# Altium schematic sheet USB Sheet (FT232RL).SchDoc
size A4
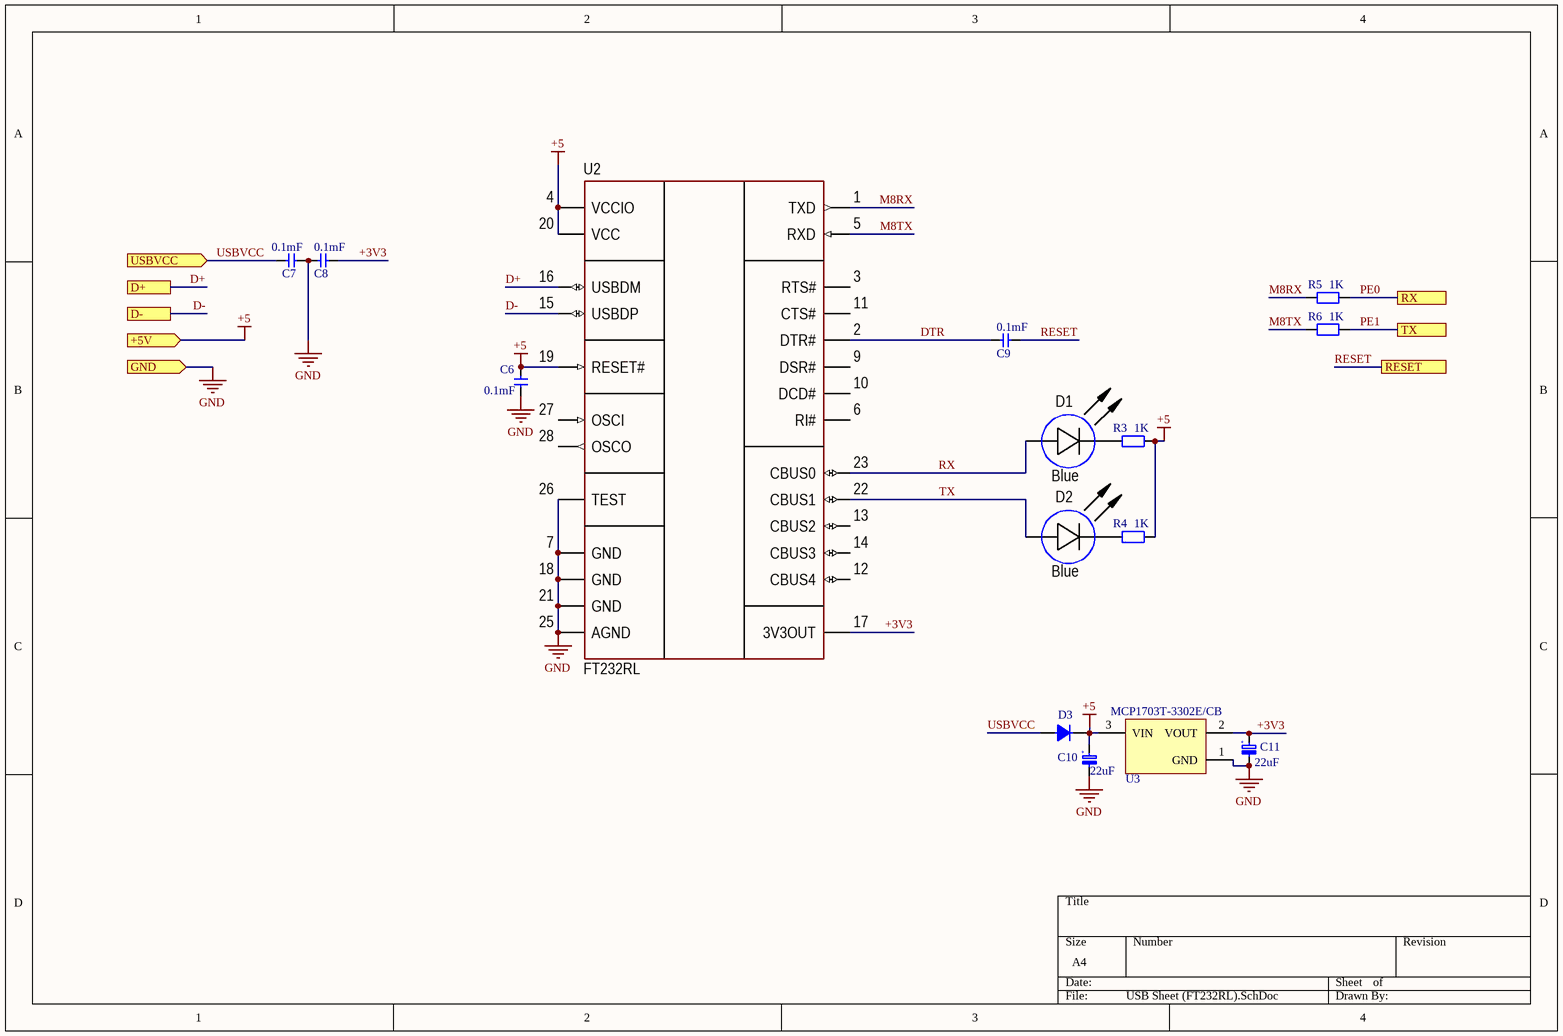
[diagram p0: USB Sheet (FT232RL).SchDoc]

## Parts
C6  0.1mF  [cap0603]
C7  0.1mF  [cap0603]
C8  0.1mF  [cap0603]
C9  0.1mF  [cap0603]
C10  22uF  [Tantal B]
C11  22uF  [Tantal B]
D1  Blue  [CH0805LB]
D2  Blue  [CH0805LB]
D3  Diode SMD  [SOD123]  (value not drawn)
R3  1K  [res0603]
R4  1K  [res0603]
R5  1K  [res0603]
R6  1K  [res0603]
U2  FT232RL  [28-SSOP]
U3  MCP1703T-3302E/CB  [SOT23-3_A]

## Ports
+5V (in), D+, D-, GND (in), RESET, RX, TX, USBVCC (in)

## Nets
+5: C6.2 C10.2(PLUS) D3.2 R3.2 R4.2 U2.4(VCCIO) U2.19(RESET#) U2.20(VCC) U3.3(VIN) ; port +5V
GND: C6.1 C7.2 C8.1 C10.1(MINUS) C11.1(MINUS) U2.7(GND) U2.18(GND) U2.21(GND) U2.25(AGND) U2.26(TEST) U3.1(GND) ; port GND
+3V3: C8.2 C11.2(PLUS) U2.17(3V3OUT) U3.2(VOUT)
D+: U2.16(USBDM) ; port D+
D-: U2.15(USBDP) ; port D-
DTR: C9.1 U2.2(DTR#)
M8RX: R5.1 U2.1(TXD)
M8TX: R6.1 U2.5(RXD)
PE0: R5.2 ; port RX
PE1: R6.2 ; port TX
RESET: C9.2 ; port RESET
RX: D1.1(A) U2.23(CBUS0)
TX: D2.1(A) U2.22(CBUS1)
USBVCC: C7.1 D3.1 ; port USBVCC
NetD1_2: D1.2(C) R3.1
NetD2_2: D2.2(C) R4.1

Not connected (* = marked no-connect by the designer): U2 3(RTS#) 6(RI#) 9(DSR#) 10(DCD#) 11(CTS#) 12(CBUS4) 13(CBUS2) 14(CBUS3) 27(OSCI) 28(OSCO)

## Notes on the sheet
- (in symbol Cap Tantal) +

## Library data of the parts
C6-C9 = Cap SMD
C10 C11 = Cap Tantal
D1 D2 = LED: Manufacturer: *; Model: *; HelpURL: *; ComponentKind: *; Value: *
R3-R6 = Resistor SMD
U2 = FT232RL: USB-UART; Manufacturer: FTDI, Future Technology Devices International Ltd; Model: FT232RL-REEL; HelpURL: https://www.digikey.com/product-detail/en/ftdi-future-technology-devices-international-ltd/FT232RL-REEL/768-1007-1-ND/1836402; ComponentKind: SSOP-28
U3 = MCP1703T-3302E/CB: 250 mA, 16V, Low Quiescent Current LDO Regulator, 3-Pin SOT-23A, Extended Temperature, Tape and Reel; Published: 29-Jan-2009; DatasheetVersion: revD, Sep-2009; PackageVersion: revBB, Aug-2009; PackageReference: SOT-23A-CB3; Publisher: Altium Limited; PackageDescription: 3-Lead Plastic Small Outline Transistor (CB) [SOT-23A]; Supplier 1: Digi-Key; Supplier Part Number 1: MCP1703T-3302E/CBTR-ND; Supplier 2: Digi-Key; Supplier Part Number 2: MCP1703T-3302E/CBCT-ND; Supplier 3: Digi-Key; Supplier Part Number 3: MCP1703T-3302E/CBDKR-ND; Supplier 4: Farnell; Supplier Part Number 4: 1439518; ComponentLink1Description: Datasheet; ComponentLink1URL: http://ww1.microchip.com/downloads/en/DeviceDoc/22049d.pdf; ComponentLink2Description: Packaging Specification; ComponentLink2URL: http://www.microchip.com/stellent/groups/techpub_sg/documents/packagingspec/en012702.pdf; ComponentLink3Description: Microchip.com Home; ComponentLink3URL: http://www.microchip.com/